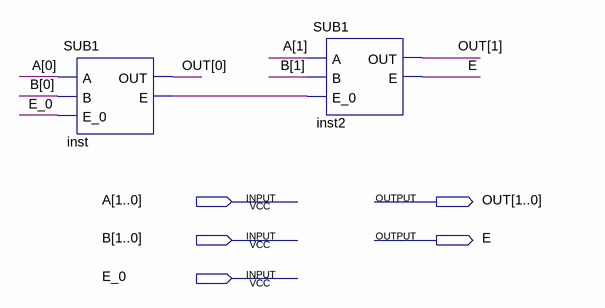
[diagram p0: schematic sheet]
// Quartus schematic SUB2.bdf as structural Verilog: 2 symbols, 5 pins
module SUB2 (
  input  [1:0] A,
  input  [1:0] B,
  input  E_0,
  output [1:0] OUT,
  output E
);

  wire inst_e;

  SUB1 inst (.A(A[0]), .B(B[0]), .E_0(E_0), .OUT(OUT[0]), .E(inst_e));
  SUB1 inst2 (.A(A[1]), .B(B[1]), .E_0(inst_e), .OUT(OUT[1]), .E(E));
endmodule
